# EAGLE design main_board (EAGLE 7.2.0)
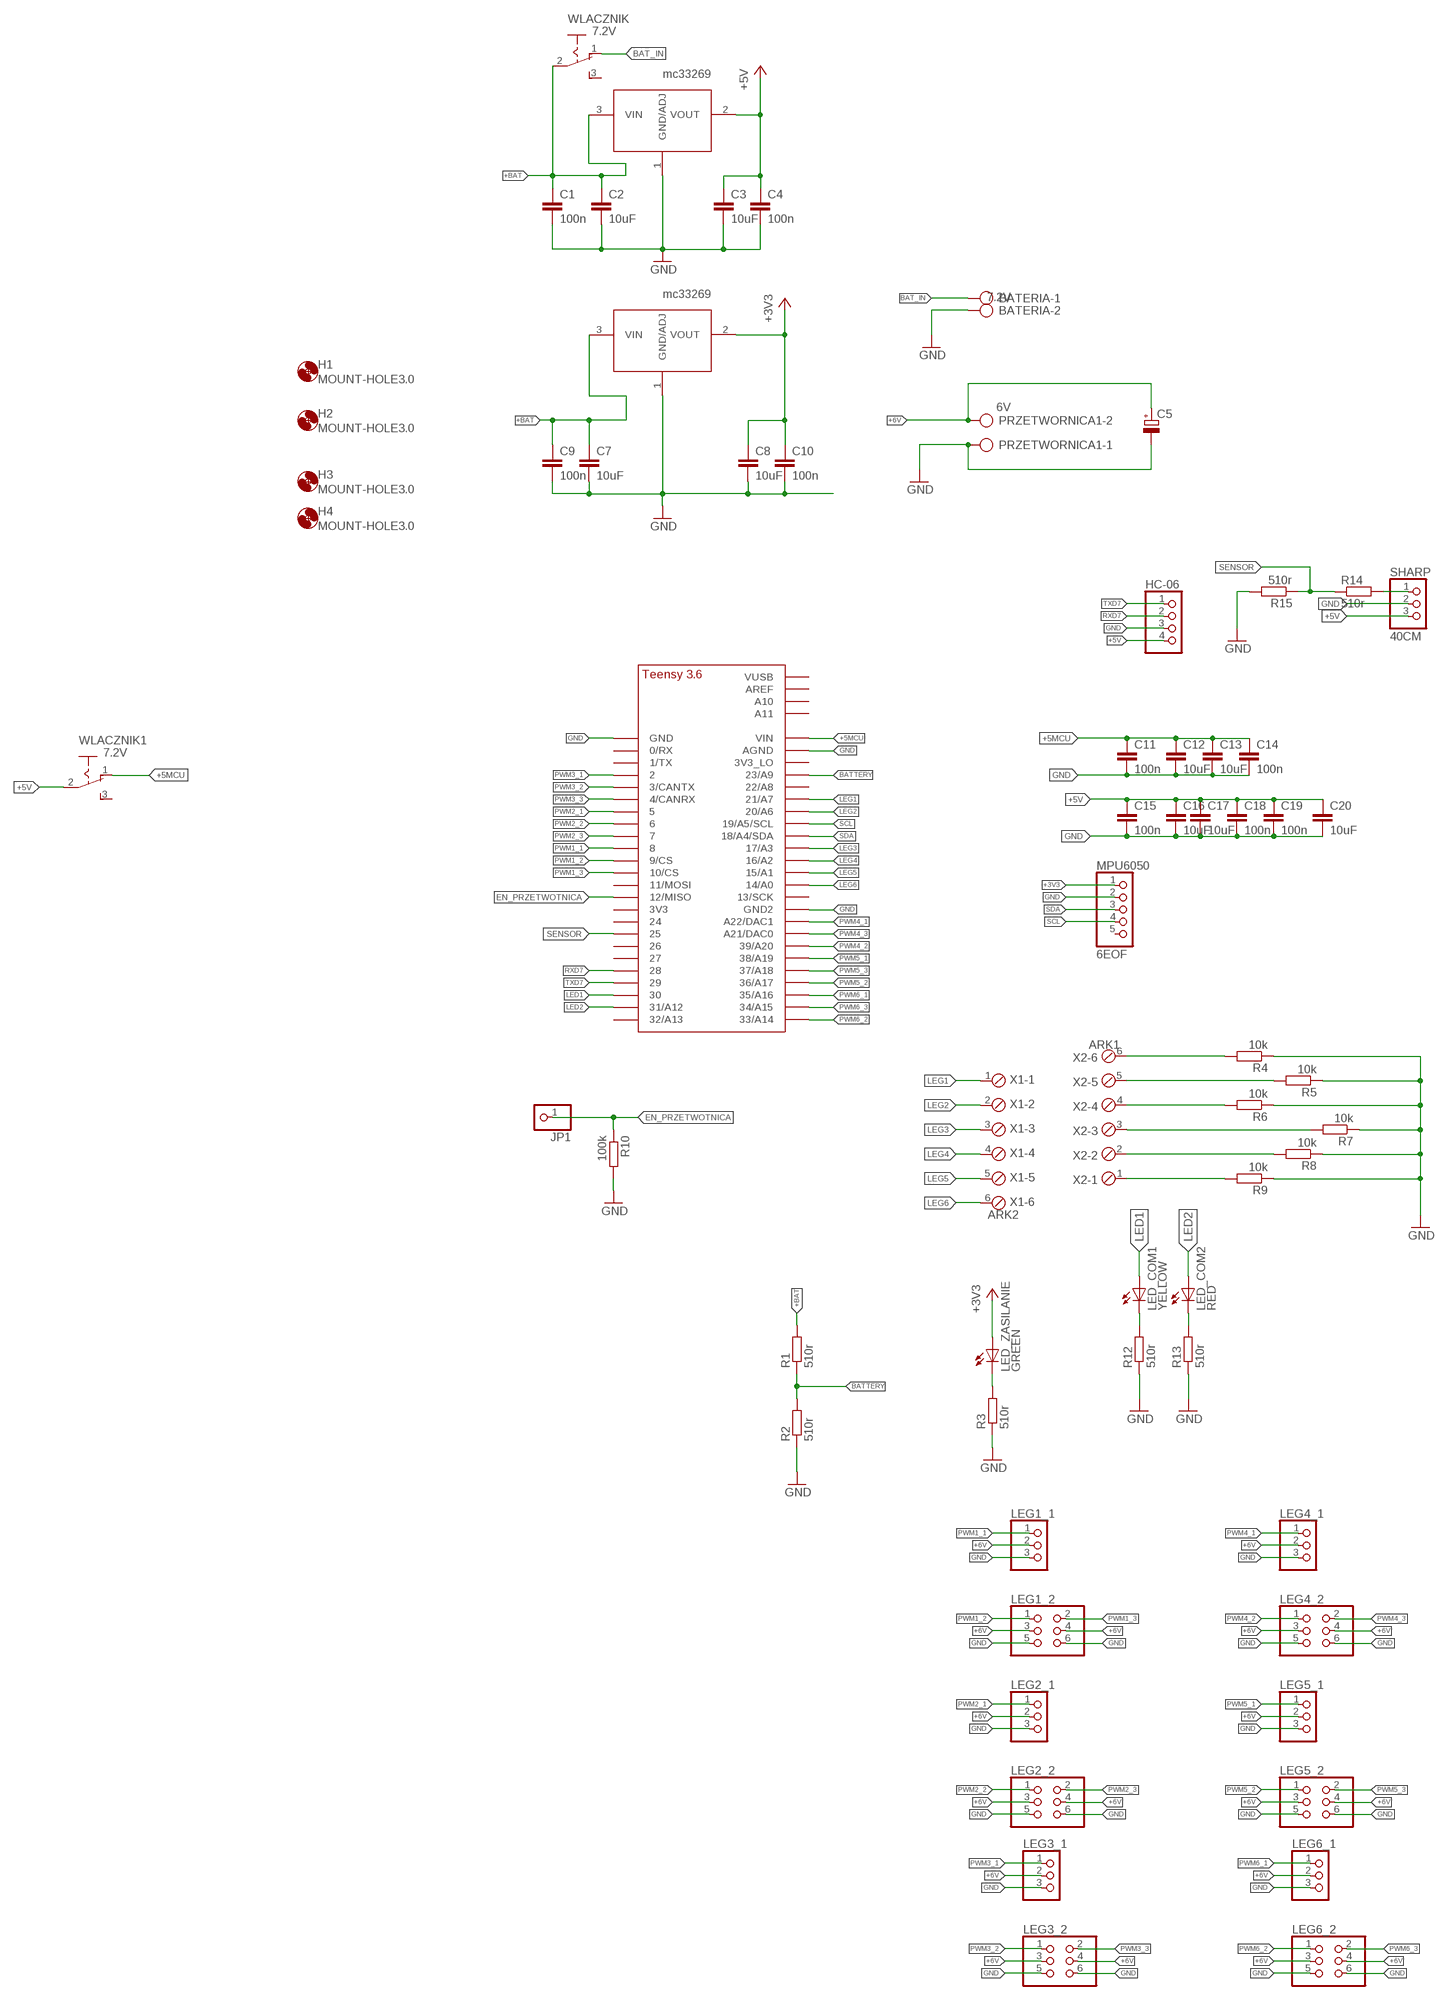
[diagram p0: schematic, sheet 1]

## Parts
3V  MC33269  [TO220]
5V  MC33269  [TO220]
BATERIA  7.2V  AK300/2  [AK300/2]
C1  100n  C-EUC0805  [C0805]
C2  10uF  C-EUC1206  [C1206]
C3  10uF  C-EUC1206  [C1206]
C4  100n  C-EUC0805  [C0805]
C5  CPOL-EU150CLZ-1014  [150CLZ-1014]
C7  10uF  C-EUC1206  [C1206]
C8  10uF  C-EUC1206  [C1206]
C9  100n  C-EUC0805  [C0805]
C10  100n  C-EUC0805  [C0805]
C11  100n  C-EUC0805  [C0805]
C12  10uF  C-EUC1206  [C1206]
C13  10uF  C-EUC1206  [C1206]
C14  100n  C-EUC0805  [C0805]
C15  100n  C-EUC0805  [C0805]
C16  10uF  C-EUC1206  [C1206]
C17  10uF  C-EUC1206  [C1206]
C18  100n  C-EUC0805  [C0805]
C19  100n  C-EUC0805  [C0805]
C20  10uF  C-EUC1206  [C1206]
H1  MOUNT-HOLE3.0  [3,0]
H2  MOUNT-HOLE3.0  [3,0]
H3  MOUNT-HOLE3.0  [3,0]
H4  MOUNT-HOLE3.0  [3,0]
HC-06  PINHD-1X4  [1X04]
JP1  PINHD-1X1  [1X01]
LED_COM1  YELLOW  LEDSML0805  [SML0805]
LED_COM2  RED  LEDSML0805  [SML0805]
LED_ZASILANIE  GREEN  LEDSML0805  [SML0805]
LEG1_1  PINHD-1X3  [1X03]
LEG1_2  PINHD-2X3  [2X03]
LEG2_1  PINHD-1X3  [1X03]
LEG2_2  PINHD-2X3  [2X03]
LEG3_1  PINHD-1X3  [1X03]
LEG3_2  PINHD-2X3  [2X03]
LEG4_1  PINHD-1X3  [1X03]
LEG4_2  PINHD-2X3  [2X03]
LEG5_1  PINHD-1X3  [1X03]
LEG5_2  PINHD-2X3  [2X03]
LEG6_1  PINHD-1X3  [1X03]
LEG6_2  PINHD-2X3  [2X03]
MPU6050  6EOF  PINHD-1X5  [1X05]
PRZETWORNICA1  6V  AK300/2  [AK300/2]
R1  510r  R-EU_R0805  [R0805]
R2  510r  R-EU_R0805  [R0805]
R3  510r  R-EU_R0805  [R0805]
R4  10k  R-EU_R0805  [R0805]
R5  10k  R-EU_R0805  [R0805]
R6  10k  R-EU_R0805  [R0805]
R7  10k  R-EU_R0805  [R0805]
R8  10k  R-EU_R0805  [R0805]
R9  10k  R-EU_R0805  [R0805]
R10  100k  R-EU_R0805  [R0805]
R12  510r  R-EU_R0805  [R0805]
R13  510r  R-EU_R0805  [R0805]
R14  510r  R-EU_R0805  [R0805]
R15  510r  R-EU_R0805  [R0805]
SHARP  40CM  PINHD-1X3  [1X03]
TEENSY41  TEENSY_3.5/3.6_BASIC  [TEENSY_3.5/3.6_BASIC]
WLACZNIK  7.2V  255SB  [255SB]
WLACZNIK1  7.2V  255SB  [255SB]
X1  ARK2  MPT6  [6POL254]
X2  ARK1  MPT6  [6POL254]

## Nets
+3V3: 3V.2(VOUT) C8.1 C10.1 LED_ZASILANIE.A MPU6050.1
+5MCU: C11.1 C12.1 C13.1 C14.1 TEENSY41.VIN WLACZNIK1.1(O)
+5V: 5V.2(VOUT) C3.1 C4.1 C15.1 C16.1 C17.1 C18.1 C19.1 C20.1 HC-06.4 SHARP.3 WLACZNIK1.2(P)
+6V: C5.+ LEG1_1.2 LEG1_2.3 LEG1_2.4 LEG2_1.2 LEG2_2.3 LEG2_2.4 LEG3_1.2 LEG3_2.3 LEG3_2.4 LEG4_1.2 LEG4_2.3 LEG4_2.4 LEG5_1.2 LEG5_2.3 LEG5_2.4 LEG6_1.2 LEG6_2.3 LEG6_2.4 PRZETWORNICA1.2
+BAT: 3V.3(VIN) 5V.3(VIN) C1.1 C2.1 C7.1 C9.1 R1.2 WLACZNIK.2(P)
BAT_IN: BATERIA.1 WLACZNIK.1(O)
BATTERY: R1.1 R2.2 TEENSY41.23/A9
EN_PRZETWOTNICA: JP1.1 R10.1 TEENSY41.12/MISO
GND: 3V.1(GND/ADJ) 5V.1(GND/ADJ) BATERIA.2 C1.2 C2.2 C3.2 C4.2 C5.- C7.2 C8.2 C9.2 C10.2 C11.2 C12.2 C13.2 C14.2 C15.2 C16.2 C17.2 C18.2 C19.2 C20.2 HC-06.3 LEG1_1.3 LEG1_2.5 LEG1_2.6 LEG2_1.3 LEG2_2.5 LEG2_2.6 LEG3_1.3 LEG3_2.5 LEG3_2.6 LEG4_1.3 LEG4_2.5 LEG4_2.6 LEG5_1.3 LEG5_2.5 LEG5_2.6 LEG6_1.3 LEG6_2.5 LEG6_2.6 MPU6050.2 PRZETWORNICA1.1 R2.1 R3.1 R4.1 R5.1 R6.1 R7.1 R8.1 R9.1 R10.2 R12.1 R13.1 R15.2 SHARP.2 TEENSY41.AGND TEENSY41.GND TEENSY41.GND2
LED1: LED_COM1.A TEENSY41.30
LED2: LED_COM2.A TEENSY41.31/A12
LEG1: TEENSY41.21/A7 X1.1
LEG2: TEENSY41.20/A6 X1.2
LEG3: TEENSY41.17/A3 X1.3
LEG4: TEENSY41.16/A2 X1.4
LEG5: TEENSY41.15/A1 X1.5
LEG6: TEENSY41.14/A0 X1.6
N$1: R4.2 X2.6
N$2: R5.2 X2.5
N$3: R6.2 X2.4
N$4: LED_ZASILANIE.C R3.2
N$5: R7.2 X2.3
N$6: R8.2 X2.2
N$7: R9.2 X2.1
N$8: LED_COM1.C R12.2
N$9: LED_COM2.C R13.2
N$10: R14.2 SHARP.1
PWM1_1: LEG1_1.1 TEENSY41.8
PWM1_2: LEG1_2.1 TEENSY41.9/CS
PWM1_3: LEG1_2.2 TEENSY41.10/CS
PWM2_1: LEG2_1.1 TEENSY41.5
PWM2_2: LEG2_2.1 TEENSY41.6
PWM2_3: LEG2_2.2 TEENSY41.7
PWM3_1: LEG3_1.1 TEENSY41.2
PWM3_2: LEG3_2.1 TEENSY41.3/CANTX
PWM3_3: LEG3_2.2 TEENSY41.4/CANRX
PWM4_1: LEG4_1.1 TEENSY41.A22/DAC1
PWM4_2: LEG4_2.1 TEENSY41.39/A20
PWM4_3: LEG4_2.2 TEENSY41.21/DAC0(A21/DAC0)
PWM5_1: LEG5_1.1 TEENSY41.38/A19
PWM5_2: LEG5_2.1 TEENSY41.36/A17
PWM5_3: LEG5_2.2 TEENSY41.37/A18
PWM6_1: LEG6_1.1 TEENSY41.35/A16
PWM6_2: LEG6_2.1 TEENSY41.33/A14
PWM6_3: LEG6_2.2 TEENSY41.34/A15
RXD7: HC-06.2 TEENSY41.28
SCL: MPU6050.4 TEENSY41.19/A5/SCL
SDA: MPU6050.3 TEENSY41.18/A4/SDA
SENSOR: R14.1 R15.1 TEENSY41.25
TXD7: HC-06.1 TEENSY41.29
Unconnected: MPU6050.5 TEENSY41.0/RX TEENSY41.1/TX TEENSY41.3V3 TEENSY41.3V3_LO TEENSY41.11/MOSI TEENSY41.13/SCK TEENSY41.22/A8 TEENSY41.24 TEENSY41.26 TEENSY41.27 TEENSY41.32/A13 TEENSY41.A10 TEENSY41.A11 TEENSY41.AREF TEENSY41.VUSB WLACZNIK1.3(S) WLACZNIK.3(S)

## Library data of the parts
3V 5V = mc33269:MC33269: MC33269 voltage regulator, by ON semiconductor, in TO220 package
BATERIA PRZETWORNICA1 = con-ptr500:AK300/2: CONNECTOR; OC_FARNELL: unknown; OC_NEWARK: unknown
C1-C4 C7-C20 = rcl:C-EU: CAPACITOR, European symbol
C5 = rcl:CPOL-EU: POLARIZED CAPACITOR, European symbol
H1-H4 = holes:MOUNT-HOLE: MOUNTING HOLE with drill center marker
HC-06 = pinhead:PINHD-1X4: PIN HEADER
JP1 = pinhead:PINHD-1X1: PIN HEADER
LED_COM1 LED_COM2 LED_ZASILANIE = led:LED: LED OSRAM: - CHIPLED LG R971, LG N971, LY N971, LG Q971, LY Q971, LO R971, LY R971 LH N974, LH R974 LS Q976, LO Q976, LY Q976 LO Q996 - Hyper CHIPLED LW Q18S LB Q993, LB Q99A, LB R99A - SideLED LS A670, LO A670, LY A670, LG A670, LP A670 LB A673, LV A673, LT A673, LW A673 LH A674 LY A675 LS A676, LA A676, LO A676, LY A676, LW A676 LS A679, LY A679, LG A679 - Hyper Micro SIDELED® LS Y876, LA Y876, LO Y876, LY Y876 LT Y87S - SmartLED LW L88C, LW L88S LB L89C, LB L89S, LG L890 LS L89K, LO L89K, LY L89K LS L896, LA L896, LO L896, LY L896 - TOPLED LS T670, LO T670, LY T670, LG T670, LP T670 LSG T670, LSP T670, LSY T670, LOP T670, LYG T670 LG T671, LOG T671, LSG T671 LB T673, LV T673, LT T673, LW T673 LH T674 LS T676, LA T676, LO T676, LY T676, LB T676, LH T676, LSB T676, LW T676 LB T67C, LV T67C, LT T67C, LS T67K, LO T67K, LY T67K, LW E67C LS E67B, LA E67B, LO E67B, LY E67B, LB E67C, LV E67C, LT E67C LW T67C LS T679, LY T679, LG T679 LS T770, LO T770, LY T770, LG T770, LP T770 LB T773, LV T773, LT T773, LW T773 LH T774 LS E675, LA E675, LY E675, LS T675 LS T776, LA T776, LO T776, LY T776, LB T776 LHGB T686 LT T68C, LB T68C - Hyper Mini TOPLED® LB M676 - Mini TOPLED Santana® LG M470 LS M47K, LO M47K, LY M47K Source: http://www.osram.convergy.de LUXEON: - LUMILED® LXK2-PW12-R00, LXK2-PW12-S00, LXK2-PW14-U00, LXK2-PW14-V00 LXK2-PM12-R00, LXK2-PM12-S00, LXK2-PM14-U00 LXK2-PE12-Q00, LXK2-PE12-R00, LXK2-PE12-S00, LXK2-PE14-T00, LXK2-PE14-U00 LXK2-PB12-K00, LXK2-PB12-L00, LXK2-PB12-M00, LXK2-PB14-N00, LXK2-PB14-P00, LXK2-PB14-Q00 LXK2-PR12-L00, LXK2-PR12-M00, LXK2-PR14-Q00, LXK2-PR14-R00 LXK2-PD12-Q00, LXK2-PD12-R00, LXK2-PD12-S00 LXK2-PH12-R00, LXK2-PH12-S00 LXK2-PL12-P00, LXK2-PL12-Q00, LXK2-PL12-R00 Source: www.luxeon.com KINGBRIGHT: KA-3528ASYC Source: www.kingbright.com
LEG1_1 LEG2_1 LEG3_1 LEG4_1 LEG5_1 LEG6_1 SHARP = pinhead:PINHD-1X3: PIN HEADER
LEG1_2 LEG2_2 LEG3_2 LEG4_2 LEG5_2 LEG6_2 = pinhead:PINHD-2X3: PIN HEADER
MPU6050 = pinhead:PINHD-1X5: PIN HEADER
R1-R10 R12-R15 = rcl:R-EU_: RESISTOR, European symbol
TEENSY41 = teensy:TEENSY_3.5/3.6_BASIC
WLACZNIK WLACZNIK1 = switch:255SB: SLIDING SWITCH Distributor Buerklin, 11G810
X1 X2 = con-phoenix-254:MPT6: PHOENIX CONNECTOR; OC_FARNELL: unknown; OC_NEWARK: unknown

## Board
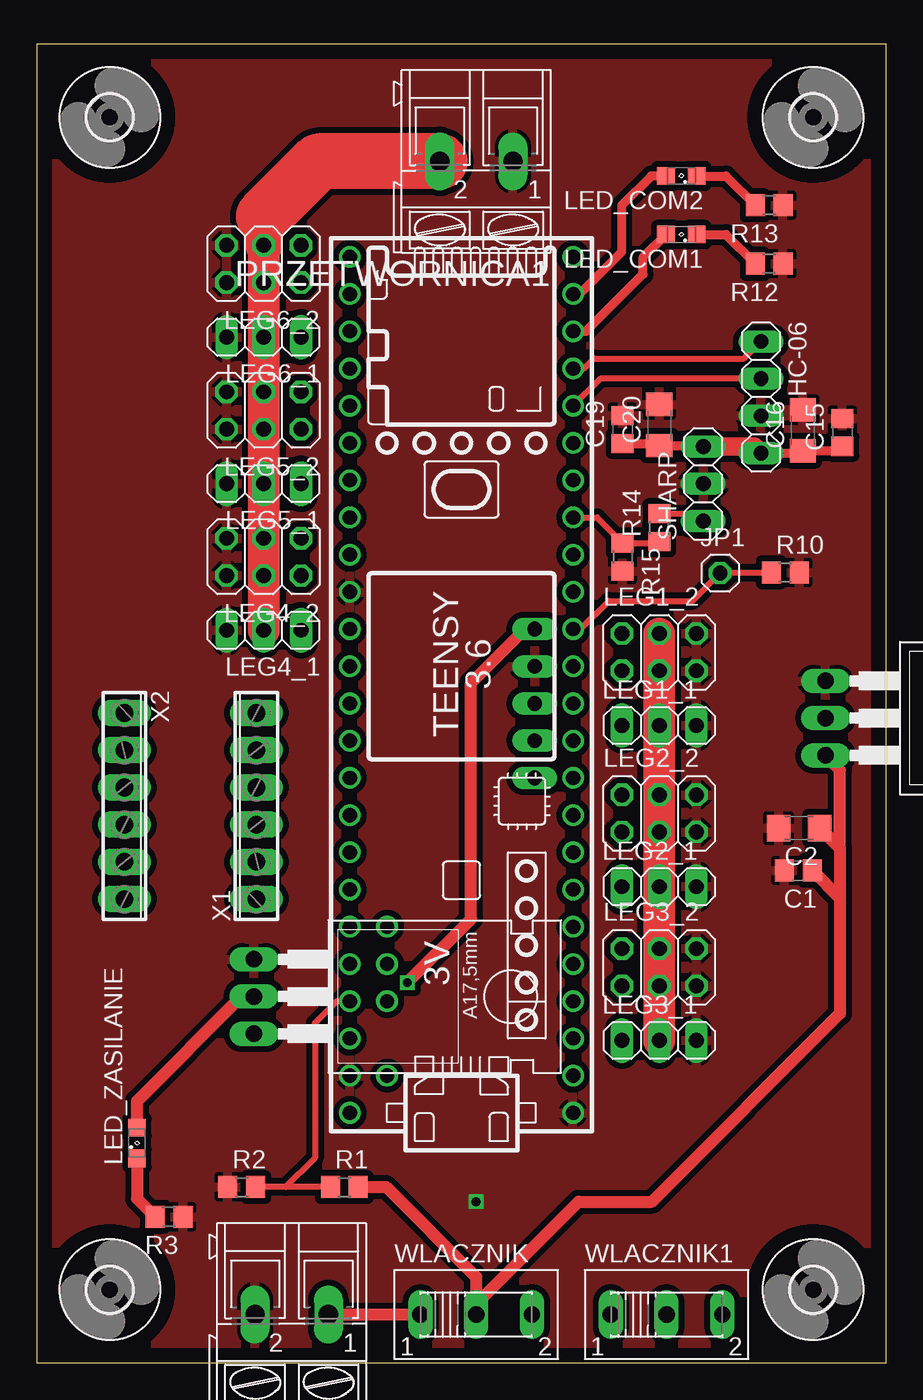
[diagram p1: board, top side]
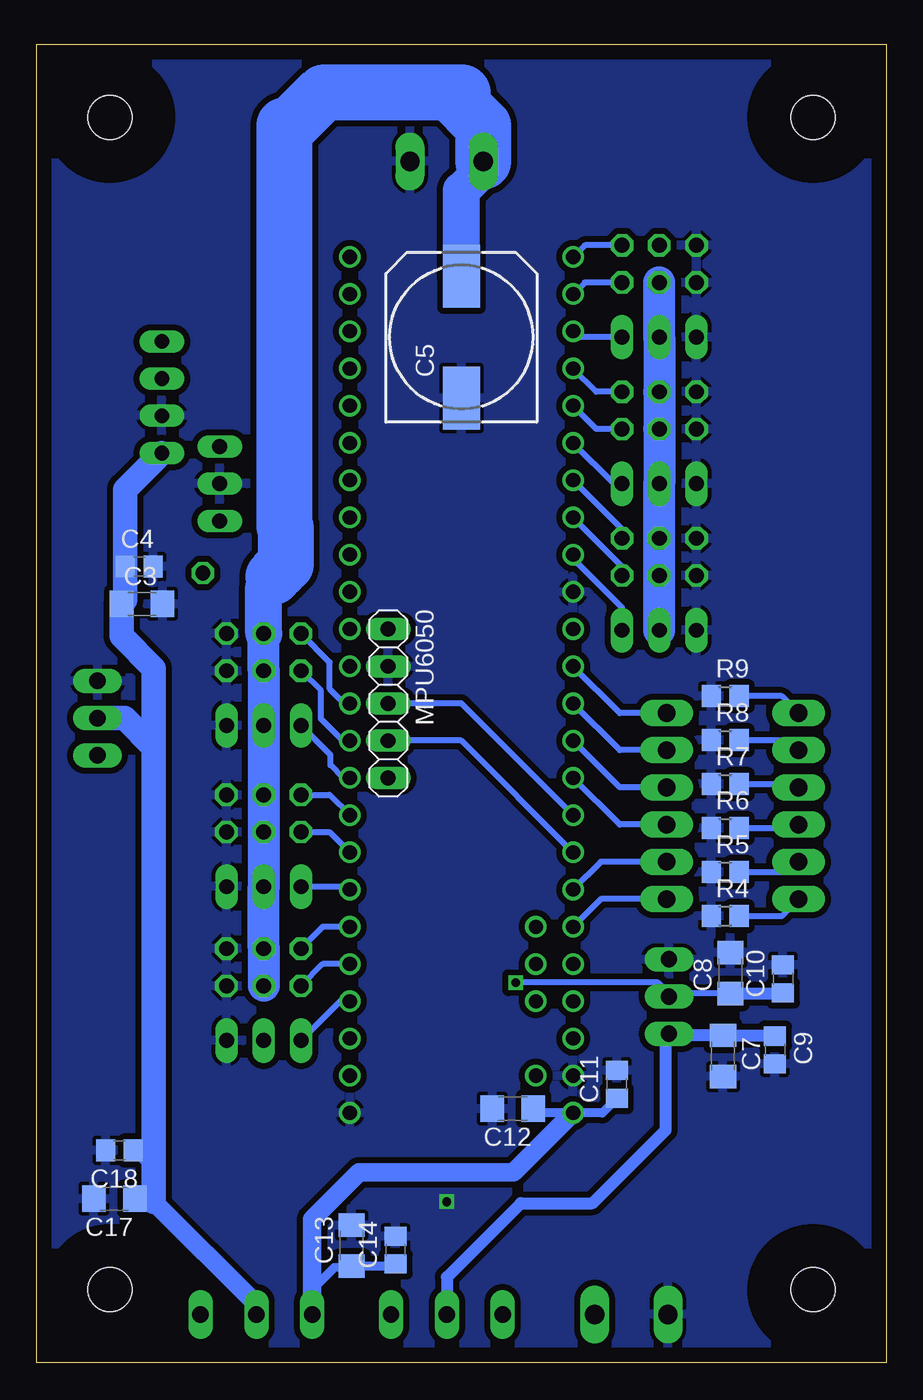
[diagram p2: board, bottom side, seen from below]

Size 58 x 90 mm. Coordinates in mm from the lower left corner, seen from the top.
Outline: 0,0 58,0 58,90 0,90 0,0
Copper layers (1*16): Top 0.035mm / dielectric 1.5mm / Bottom 0.035mm
Design rules "default *": minimum track width 10mil, minimum drill 0.00761875mm, track to track 8mil, track to pad 8mil, pad to pad 8mil, via to via 8mil, smd to smd 8mil, copper to edge 40mil, drill to drill 8mil, minimum pad ring 10mil, minimum via ring 8mil, stop-mask expansion 4mil, vias tented up to drill 0mil, thermal gap 10mil

### Footprints (pad centres in the part's own frame; a part is rotated, then mirrored left to right if it is on the bottom)
TO220 = drill 1.118 long: 1 -2.54,-10.16; 2 0,-10.16; 3 2.54,-10.16
AK300/2 = drill 1.321 long: 1 -2.515,0; 2 2.489,0
C0805 = smd 1.3 x 1.5: 1 -0.95,0; 2 0.95,0
C1206 = smd 1.6 x 1.8: 1 -1.4,0; 2 1.4,0
150CLZ-1014 = smd 4.3 x 2.5: + 4.15,0; - -4.15,0
3,0 = hole 3: 0,0
1X04 = drill 1.016 long: 1 -3.81,0; 2 -1.27,0; 3 1.27,0; 4 3.81,0
1X01 = drill 1.016 octagon: 1 0,0
SML0805 = smd 1.2 x 1.2: A 1.05,0; C -1.05,0
1X03 = drill 1.016 long: 1 -2.54,0; 2 0,0; 3 2.54,0
2X03 = drill 1.016 octagon: 1 -2.54,-1.27; 2 -2.54,1.27; 3 0,-1.27; 4 0,1.27; 5 2.54,-1.27; 6 2.54,1.27
1X05 = drill 1.016 long: 1 -5.08,0; 2 -2.54,0; 3 0,0; 4 2.54,0; 5 5.08,0
R0805 = smd 1.3 x 1.5: 1 -0.95,0; 2 0.95,0
TEENSY_3.5/3.6_BASIC = drill 0.965: 0/RX -25.4,-7.62; 1/TX -22.86,-7.62; 2 -20.32,-7.62; 3/CANTX -17.78,-7.62; 3V3 7.62,-7.62; 3V3_LO -22.86,7.62; 4/CANRX -15.24,-7.62; 5 -12.7,-7.62; 6 -10.16,-7.62; 7 -7.62,-7.62; 8 -5.08,-7.62; 9/CS -2.54,-7.62; 10/CS 0,-7.62; 11/MOSI 2.54,-7.62; 12/MISO 5.08,-7.62; 13/SCK 5.08,7.62; 14/A0 2.54,7.62; 15/A1 0,7.62; 16/A2 -2.54,7.62; 17/A3 -5.08,7.62; 18/A4/SDA -7.62,7.62; 19/A5/SCL -10.16,7.62; 20/A6 -12.7,7.62; 21/A7 -15.24,7.62; 21/DAC0 12.7,7.62; 22/A8 -17.78,7.62; 23/A9 -20.32,7.62; 24 10.16,-7.62; 25 12.7,-7.62; 26 15.24,-7.62; 27 17.78,-7.62; 28 20.32,-7.62; 29 22.86,-7.62; 30 25.4,-7.62; 31/A12 27.94,-7.62; 32/A13 30.48,-7.62; 33/A14 30.48,7.62; 34/A15 27.94,7.62; 35/A16 25.4,7.62; 36/A17 22.86,7.62; 37/A18 20.32,7.62; 38/A19 17.78,7.62; 39/A20 15.24,7.62; A10 -17.78,5.08; A11 -15.24,5.08; A22/DAC1 10.16,7.62; AGND -25.4,7.62; AREF -20.32,5.08; GND -27.94,-7.62; GND2 7.62,7.62; VIN -27.94,7.62; VUSB -25.4,5.08
255SB = drill 1.118 long: 1 -3.81,0; 2 0,0; 3 3.81,0
6POL254 = drill 1.2 pad 1.778 long: 1 -6.35,0; 2 -3.81,0; 3 -1.27,0; 4 1.27,0; 5 3.81,0; 6 6.35,0

### Placement (x,y rotation side)
3V  25,25 270 top
5V  64,44 270 top
BATERIA  17.4,3.3 180 top
C1  52,33.6 180 top
C2  52.05,36.5 180 top
C3  50.8,51.8 0 bottom
C4  51,54.35 0 bottom
C5  29,70 90 bottom
C7  11.15,20.95 270 bottom
C8  10.65,26.6 90 bottom
C9  7.6,21.35 270 bottom
C10  7.05,26.2 90 bottom
C11  18.4,19 90 bottom
C12  25.5,17.35 180 bottom
C13  36.5,8 90 bottom
C14  33.5,7.7 90 bottom
C15  55,63.5 90 top
C16  52.3,63.65 90 top
C17  52.7,11.2 180 bottom
C18  52.35,14.5 180 bottom
C19  40,63.7 90 top
C20  42.5,64 90 top
H1  53,85 0 top
H2  5,85 0 top
H3  53,5 0 top
H4  5,5 0 top
HC-06  49.45,65.9 270 top
JP1  46.65,53.9 0 top
LED_COM1  44,77 180 top
LED_COM2  44,81 180 top
LED_ZASILANIE  6.85,15.01 90 top
LEG1_1  42.5,43.5 0 top
LEG1_2  42.5,48.5 0 top
LEG2_1  42.5,32.5 0 top
LEG2_2  42.5,37.5 0 top
LEG3_1  42.5,22 0 top
LEG3_2  42.5,27 0 top
LEG4_1  15.5,50 180 top
LEG4_2  15.5,55 180 top
LEG5_1  15.5,60 180 top
LEG5_2  15.5,65 180 top
LEG6_1  15.5,70 180 top
LEG6_2  15.5,75 180 top
MPU6050  34,45 270 bottom
PRZETWORNICA1  30,82 180 top
R1  21,12 0 top
R2  14,12 0 top
R3  9.04,9.97 180 top
R4  11,30.5 0 bottom
R5  11,33.5 0 bottom
R6  11,36.5 0 bottom
R7  11,39.5 0 bottom
R8  11,42.5 0 bottom
R9  11,45.5 0 bottom
R10  51.1,53.95 0 top
R12  50,75 180 top
R13  50,79 180 top
R14  42.5,57 90 top
R15  40,55 270 top
SHARP  45.5,60 90 top
TEENSY41  29,45 90 top
WLACZNIK  30,3.3 0 top
WLACZNIK1  43,3.3 0 top
X1  15,38 90 top
X2  6,38 270 top

### Tracks (layer width: path | path; a pad name or v marks a point on that pad's centre or on a via)
+3V3  (via drill 0.6)
  Top 0.813: LED_ZASILANIE.A 6.85,17.85 14,25 3V.2 | v25.3,25.95 29.65,30.3 29.65,46.4 33.33,50.08 MPU6050.1
  Bottom 0.406: C8.1 14.84,25.2 | 14.84,25.2 3V.2 | 14.84,25.2 15.59,25.95 v25.3,25.95
  Bottom 0.813: C8.1 7.1,25.2 C10.1
+5MCU
  Bottom 0.61: C12.1 23.71,17.06 TEENSY41.VIN 19.39,17.06 C11.1 | C14.1 33.65,6.6 C13.1 37.69,6.5 39.19,5 WLACZNIK1.1
  Bottom 1.27: TEENSY41.VIN 25.44,13 36,13 39.19,9.81 WLACZNIK1.1
+5V
  Top 0.61: C19.1 42.35,62.75 C20.1 45.44,62.6 SHARP.3 | HC-06.4 52.3,62.09 C16.1 55,62.25 C15.1
  Top 1.27: SHARP.3 49,62.54 HC-06.4
  Bottom 0.406: C18.1 51.4,14.4 50,13 | C17.1 50.2,11.2 50,11
  Bottom 1.27: 50,11 43,4 WLACZNIK1.2
  Bottom 1.676: 50,42 50,47.4 52.2,49.6 C3.1 51.95,52.05 C4.1 51.95,59.59 HC-06.4 | 50,42 50,13 50,11 | 5V.2 52,44 50,42
+6V
  Top 2.184: LEG6_2.3 LEG4_1.2 | LEG3_1.2 LEG1_2.4
  Top 2.54: LEG6_2.3 15.5,78.25
  Top 3.81: PRZETWORNICA1.2 19.25,82 15.5,78.25
  Bottom 2.184: LEG6_2.4 LEG6_1.2 LEG5_2.3 LEG5_2.4 LEG5_1.2 LEG4_2.3 LEG4_2.4 LEG4_1.2 | LEG3_2.3 LEG3_2.4 LEG2_1.2 LEG2_2.3 LEG2_2.4 LEG1_1.2 LEG1_2.3 LEG1_2.4
  Bottom 2.54: LEG1_2.4 42.5,53 41.25,54.25 | C5.+ 29,80 27,82 27,83.9 27.51,84.41
  Bottom 3.81: 41.85,53.65 41.25,54.25 41,54.5 41,57 41.1,57.1 41.1,84.45 40.65,84.45 38.4,86.7 29.8,86.7 | 29.8,86.7 28.95,86.7 28.9,86.65 | PRZETWORNICA1.2 27.51,84.41 29.8,86.7
+BAT
  Top 0.813: 54.84,35.11 54.84,31.71 | 54.84,31.71 54.84,23.84 42,11 37,11 30,4 WLACZNIK.2 30,5.85 23.85,12 R1.2 | C1.1 54.84,31.71 | C2.1 54.84,35.11 | 54.84,35.11 54.84,40.46 5V.3
  Bottom 0.813: C9.1 7.65,22.35 C7.1 14.73,22.35 3V.3 15.05,22.25 15.05,15.9 20.05,10.9 24.95,10.9 30,5.85 WLACZNIK.2
BAT_IN
  Top 0.813: BATERIA.1 WLACZNIK.1
BATTERY
  Top 0.406: R1.1 17,12 | 17,12 R2.2 | 17,12 19,14 19,23.2 20.48,24.68 TEENSY41.23/A9
EN_PRZETWOTNICA
  Top 0.406: TEENSY41.12/MISO 37.13,50.08 39.05,52 44.75,52 JP1.1 50.1,53.9 R10.1
GND  (via drill 0.6)
  other vias: 30,11
  pour Top (isolate 0.406): -68,-45 135,-45 135,132 -68,132
  pour Bottom (isolate 0.406): -63,-52 140,-52 140,125 -63,125
LED1
  Top 0.61: TEENSY41.30 37.5,70.4 41.4,74.3 41.4,75.45 LED_COM1.A
LED2
  Top 0.61: LED_COM2.A 41.95,81 39.95,79 39.95,75.85 37.04,72.94 TEENSY41.31/A12
LEG1
  Bottom 0.406: X1.1 19.49,31.65 TEENSY41.21/A7
LEG2
  Bottom 0.406: X1.2 19.49,34.19 TEENSY41.20/A6
LEG3
  Bottom 0.406: X1.3 18.19,36.73 TEENSY41.17/A3
LEG4
  Bottom 0.406: X1.4 18.19,39.27 TEENSY41.16/A2
LEG5
  Bottom 0.406: X1.5 18.19,41.81 TEENSY41.15/A1
LEG6
  Bottom 0.406: X1.6 18.19,44.35 TEENSY41.14/A0
N$1
  Bottom 0.406: R4.2 7.15,30.5 X2.6
N$2
  Bottom 0.406: R5.2 6.69,33.5 X2.5
N$3
  Bottom 0.406: R6.2 6.23,36.5 X2.4
N$4
  Top 0.813: LED_ZASILANIE.C 6.85,11.21 R3.2
N$5
  Bottom 0.406: R7.2 6.23,39.5 X2.3
N$6
  Bottom 0.406: R8.2 6.69,42.5 X2.2
N$7
  Bottom 0.406: X2.1 7.15,45.5 R9.2
N$8
  Top 0.61: LED_COM1.C 47.05,77 R12.2
N$9
  Top 0.61: LED_COM2.C 47.05,81 R13.2
N$10
  Top 0.406: R14.2 45.01,57.95 SHARP.1
PWM1_1
  Bottom 0.406: TEENSY41.8 37.07,39.92 37.95,40.8 37.95,41.49 LEG1_1.1
PWM1_2
  Bottom 0.406: TEENSY41.9/CS 37.11,42.46 38.6,43.95 38.6,45.87 LEG1_2.1
PWM1_3
  Bottom 0.406: TEENSY41.10/CS 37,45 38,46 38,47.81 LEG1_2.2
PWM2_1
  Bottom 0.406: LEG2_1.1 36.82,32.5 TEENSY41.5
PWM2_2
  Bottom 0.406: LEG2_2.1 38.01,36.23 TEENSY41.6
PWM2_3
  Bottom 0.406: LEG2_2.2 38.01,38.77 TEENSY41.7
PWM3_1
  Bottom 0.406: TEENSY41.2 37.28,24.68 LEG3_1.1
PWM3_2
  Bottom 0.406: TEENSY41.3/CANTX 38.47,27.22 LEG3_2.1
PWM3_3
  Bottom 0.406: TEENSY41.4/CANRX 38.47,29.76 LEG3_2.2
PWM4_1
  Bottom 0.406: TEENSY41.A22/DAC1 21.38,54.88 18.04,51.54 LEG4_1.1
PWM4_2
  Bottom 0.406: LEG4_2.1 18.04,56.9 TEENSY41.39/A20
PWM4_3
  Bottom 0.406: LEG4_2.2 18.04,54.36 TEENSY41.21/DAC0
PWM5_1
  Bottom 0.406: LEG5_1.1 18.6,60 TEENSY41.38/A19
PWM5_2
  Bottom 0.406: LEG5_2.1 19.79,66.27 TEENSY41.36/A17
PWM5_3
  Bottom 0.406: LEG5_2.2 19.79,63.73 TEENSY41.37/A18
PWM6_1
  Bottom 0.406: LEG6_1.1 20.98,70 TEENSY41.35/A16
PWM6_2
  Bottom 0.406: LEG6_2.1 20.59,76.27 TEENSY41.33/A14
PWM6_3
  Bottom 0.406: LEG6_2.2 20.59,73.73 TEENSY41.34/A15
RXD7
  Top 0.406: HC-06.2 38.47,67.17 TEENSY41.28
SCL
  Bottom 0.406: TEENSY41.19/A5/SCL 29,42.46 MPU6050.4
SDA
  Bottom 0.406: TEENSY41.18/A4/SDA 29,45 MPU6050.3
SENSOR
  Top 0.406: TEENSY41.25 38.25,57.7 R15.1 42.4,55.95 R14.1
TXD7
  Top 0.406: TEENSY41.29 37.36,67.86 38.05,68.55 48.29,68.55 HC-06.1